# Altium schematic sheet 10uF Cap.schdoc
size 124 x 101 mm
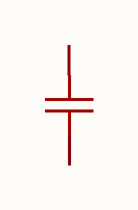
[diagram p0: 10uF Cap.schdoc]

## Parts
C?  10uF  [C1210]  (value not drawn)

## Nets

Not connected (* = marked no-connect by the designer): C? 1 2

## Library data of the parts
C? = GRM32ER61C106KA12L: Manufacturer: muRata(村田); Add into BOM: yes; Tolerance: ±10%; Symbol: GRM32ER61C106KA12L; Device: GRM32ER61C106KA12L; LCSC Part Name: 10uF ±10% 16V; Supplier Part: C184907; Manufacturer Part: GRM32ER61C106KA12L; Supplier Footprint: 1210; JLCPCB Part Class: Extended Part; Datasheet: https://atta.szlcsc.com/upload/public/pdf/source/20200305/C490387_23319AE8C154DEB24C505E6C82A8106A.pdf; Supplier: LCSC; Convert to PCB: yes; Value: 10uF